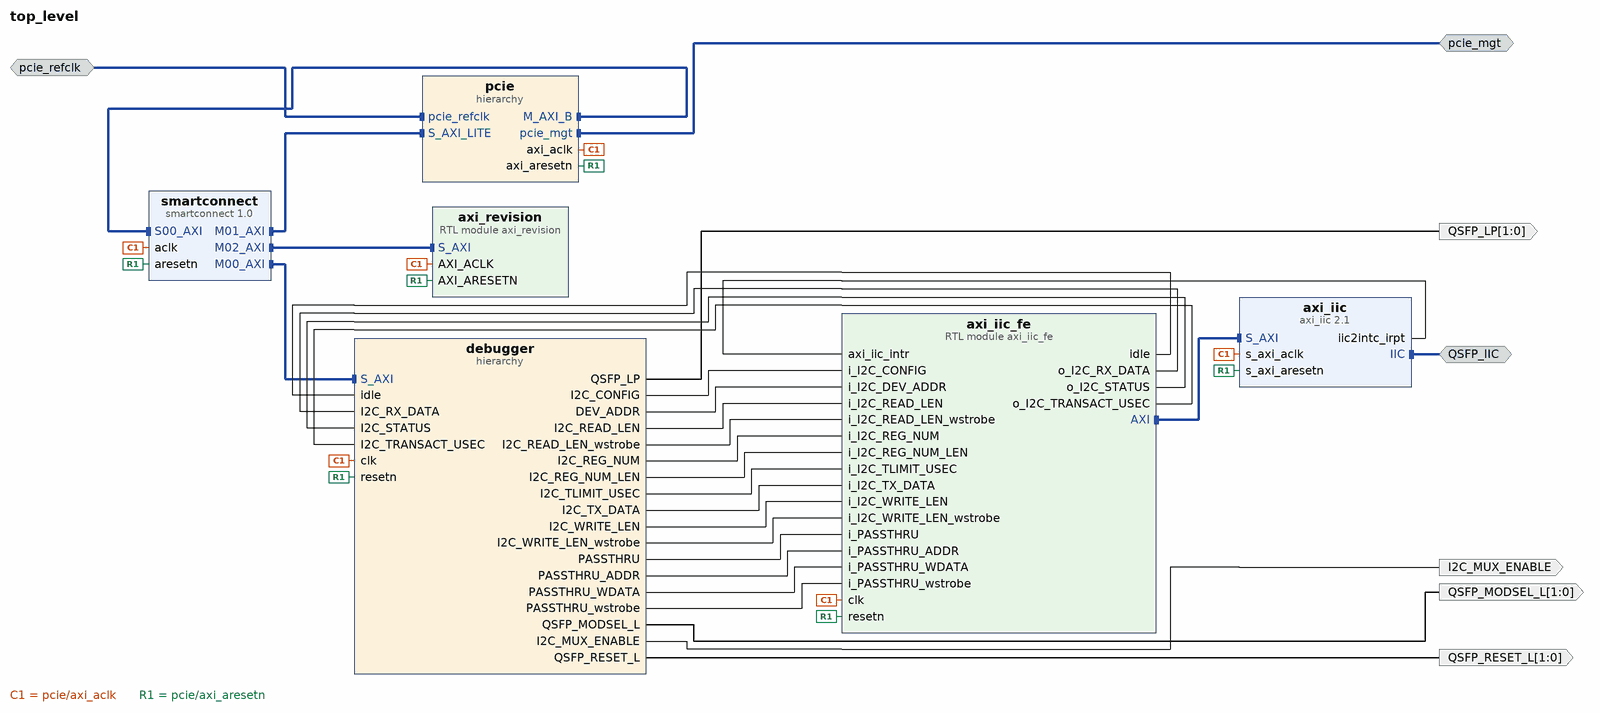
[diagram p0: block diagram of the top level]
# Vivado block design top_level, xcku15p-ffve1517-3-e, Vivado 2021.1
create_bd_design top_level

create_bd_intf_port -mode Slave -vlnv xilinx.com:interface:diff_clock_rtl:1.0 pcie_refclk
create_bd_intf_port -mode Master -vlnv xilinx.com:interface:pcie_7x_mgt_rtl:1.0 pcie_mgt
create_bd_intf_port -mode Master -vlnv xilinx.com:interface:iic_rtl:1.0 QSFP_IIC
create_bd_port -dir O -from 1 -to 0 QSFP_MODSEL_L
create_bd_port -dir O -from 1 -to 0 QSFP_RESET_L
create_bd_port -dir O -from 1 -to 0 QSFP_LP
create_bd_port -dir O I2C_MUX_ENABLE

create_bd_cell -type hier pcie
create_bd_cell -type ip -vlnv xilinx.com:ip:smartconnect:1.0 smartconnect
set_property -dict {CONFIG.NUM_CLKS 1 CONFIG.NUM_MI 3 CONFIG.NUM_SI 1} [get_bd_cells smartconnect]
create_bd_cell -type module -reference axi_revision axi_revision
create_bd_cell -type ip -vlnv xilinx.com:ip:axi_iic:2.1 axi_iic
create_bd_cell -type module -reference axi_iic_fe axi_iic_fe
set_property -dict {CONFIG.CLKS_PER_USEC 250} [get_bd_cells axi_iic_fe]
create_bd_cell -type hier debugger

# ---- hierarchy /pcie ----
current_bd_instance /pcie
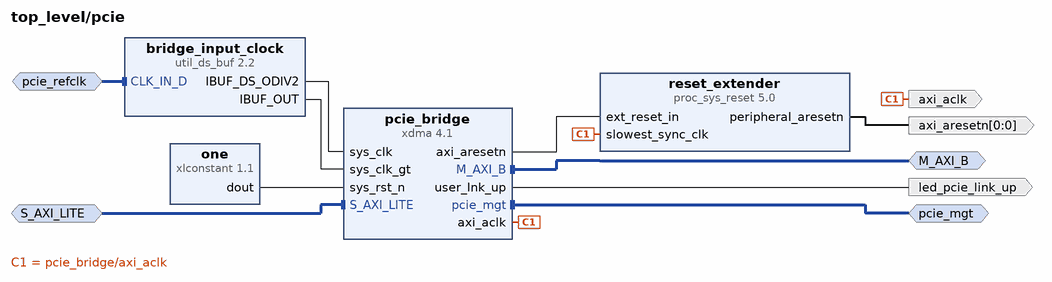
[diagram p1: block diagram inside /pcie]
create_bd_intf_pin -mode Master -vlnv xilinx.com:interface:aximm_rtl:1.0 M_AXI_B
create_bd_intf_pin -mode Slave -vlnv xilinx.com:interface:aximm_rtl:1.0 S_AXI_LITE
create_bd_intf_pin -mode Master -vlnv xilinx.com:interface:pcie_7x_mgt_rtl:1.0 pcie_mgt
create_bd_intf_pin -mode Slave -vlnv xilinx.com:interface:diff_clock_rtl:1.0 pcie_refclk
create_bd_pin -dir O led_pcie_link_up
create_bd_pin -dir O -type clk axi_aclk
create_bd_pin -dir O -from 0 -to 0 -type rst axi_aresetn

create_bd_cell -type ip -vlnv xilinx.com:ip:util_ds_buf:2.2 bridge_input_clock
set_property -dict {CONFIG.C_BUF_TYPE IBUFDSGTE} [get_bd_cells bridge_input_clock]
create_bd_cell -type ip -vlnv xilinx.com:ip:xdma:4.1 pcie_bridge
set_property -dict [list \
  CONFIG.PF0_DEVICE_ID_mqdma 903F \
  CONFIG.PF0_SRIOV_VF_DEVICE_ID A03F \
  CONFIG.PF2_DEVICE_ID_mqdma 923F \
  CONFIG.PF3_DEVICE_ID_mqdma 933F \
  CONFIG.axi_addr_width 64 \
  CONFIG.axi_data_width 512_bit \
  CONFIG.axisten_freq 250 \
  CONFIG.bridge_burst true \
  CONFIG.dma_reset_source_sel User_Reset \
  CONFIG.en_axi_slave_if false \
  CONFIG.enable_jtag_dbg false \
  CONFIG.functional_mode AXI_Bridge \
  CONFIG.mode_selection Advanced \
  CONFIG.pcie_blk_locn X0Y3 \
  CONFIG.pf0_bar0_scale Megabytes \
  CONFIG.pf0_bar0_size 1 \
  CONFIG.pf0_bar1_enabled true \
  CONFIG.pf0_bar1_scale Megabytes \
  CONFIG.pf0_bar1_size 1 \
  CONFIG.pf0_device_id 903F \
  CONFIG.pl_link_cap_max_link_speed 8.0_GT/s \
  CONFIG.pl_link_cap_max_link_width X16 \
  CONFIG.plltype QPLL1 \
] [get_bd_cells pcie_bridge]
create_bd_cell -type ip -vlnv xilinx.com:ip:xlconstant:1.1 one
create_bd_cell -type ip -vlnv xilinx.com:ip:proc_sys_reset:5.0 reset_extender

# ---- hierarchy /debugger ----
current_bd_instance /debugger
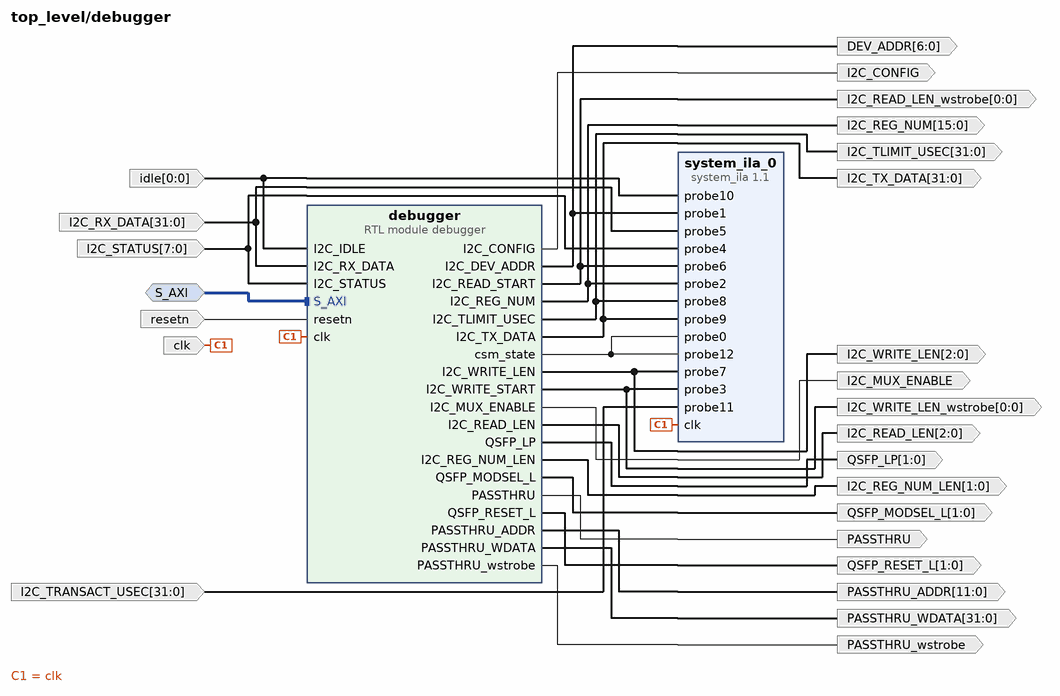
[diagram p2: block diagram inside /debugger]
create_bd_intf_pin -mode Slave -vlnv xilinx.com:interface:aximm_rtl:1.0 S_AXI
create_bd_pin -dir I -type clk clk
create_bd_pin -dir I -type rst resetn
create_bd_pin -dir O -from 1 -to 0 QSFP_MODSEL_L
create_bd_pin -dir O -from 1 -to 0 QSFP_RESET_L
create_bd_pin -dir O -from 1 -to 0 QSFP_LP
create_bd_pin -dir O I2C_MUX_ENABLE
create_bd_pin -dir O I2C_CONFIG
create_bd_pin -dir O -from 6 -to 0 DEV_ADDR
create_bd_pin -dir O -from 1 -to 0 I2C_REG_NUM_LEN
create_bd_pin -dir O -from 15 -to 0 I2C_REG_NUM
create_bd_pin -dir O -from 2 -to 0 I2C_READ_LEN
create_bd_pin -dir O -from 0 -to 0 I2C_READ_LEN_wstrobe
create_bd_pin -dir O -from 31 -to 0 I2C_TX_DATA
create_bd_pin -dir O -from 2 -to 0 I2C_WRITE_LEN
create_bd_pin -dir O -from 0 -to 0 I2C_WRITE_LEN_wstrobe
create_bd_pin -dir O -from 31 -to 0 I2C_TLIMIT_USEC
create_bd_pin -dir I -from 31 -to 0 I2C_RX_DATA
create_bd_pin -dir I -from 7 -to 0 I2C_STATUS
create_bd_pin -dir I -from 0 -to 0 idle
create_bd_pin -dir O PASSTHRU
create_bd_pin -dir O -from 31 -to 0 PASSTHRU_WDATA
create_bd_pin -dir O -from 11 -to 0 PASSTHRU_ADDR
create_bd_pin -dir O PASSTHRU_wstrobe
create_bd_pin -dir I -from 31 -to 0 I2C_TRANSACT_USEC

create_bd_cell -type ip -vlnv xilinx.com:ip:system_ila:1.1 system_ila_0
set_property -dict {CONFIG.C_MON_TYPE NATIVE CONFIG.C_NUM_OF_PROBES 15} [get_bd_cells system_ila_0]
create_bd_cell -type module -reference debugger debugger

# ---- connections ----

current_bd_instance /pcie
connect_bd_intf_net [get_bd_intf_pins pcie_refclk] [get_bd_intf_pins bridge_input_clock/CLK_IN_D]
connect_bd_intf_net -intf_net smartconnect_0_M01_AXI [get_bd_intf_pins S_AXI_LITE] [get_bd_intf_pins pcie_bridge/S_AXI_LITE]
connect_bd_intf_net -intf_net xdma_0_M_AXI_B [get_bd_intf_pins M_AXI_B] [get_bd_intf_pins pcie_bridge/M_AXI_B]
connect_bd_intf_net -intf_net xdma_0_pcie_mgt [get_bd_intf_pins pcie_mgt] [get_bd_intf_pins pcie_bridge/pcie_mgt]
connect_bd_net [get_bd_pins bridge_input_clock/IBUF_DS_ODIV2] [get_bd_pins pcie_bridge/sys_clk]
connect_bd_net [get_bd_pins bridge_input_clock/IBUF_OUT] [get_bd_pins pcie_bridge/sys_clk_gt]
connect_bd_net [get_bd_pins one/dout] [get_bd_pins pcie_bridge/sys_rst_n]
connect_bd_net [get_bd_pins pcie_bridge/axi_aresetn] [get_bd_pins reset_extender/ext_reset_in]
connect_bd_net -net proc_sys_reset_0_peripheral_aresetn [get_bd_pins reset_extender/peripheral_aresetn] [get_bd_pins axi_aresetn]
connect_bd_net -net xdma_0_axi_aclk [get_bd_pins pcie_bridge/axi_aclk] [get_bd_pins axi_aclk] [get_bd_pins reset_extender/slowest_sync_clk]
connect_bd_net -net xdma_0_user_lnk_up [get_bd_pins pcie_bridge/user_lnk_up] [get_bd_pins led_pcie_link_up]

current_bd_instance /debugger
connect_bd_intf_net -intf_net smartconnect_M00_AXI [get_bd_intf_pins S_AXI] [get_bd_intf_pins debugger/S_AXI]
connect_bd_net [get_bd_pins debugger/csm_state] [get_bd_pins system_ila_0/probe12] [get_bd_pins system_ila_0/probe0]
connect_bd_net -net axi_iic_fe_0_idle [get_bd_pins idle] [get_bd_pins system_ila_0/probe10] [get_bd_pins debugger/I2C_IDLE]
connect_bd_net -net axi_iic_fe_0_o_I2C_RX_DATA [get_bd_pins I2C_RX_DATA] [get_bd_pins system_ila_0/probe5] [get_bd_pins debugger/I2C_RX_DATA]
connect_bd_net -net axi_iic_fe_0_o_I2C_STATUS [get_bd_pins I2C_STATUS] [get_bd_pins system_ila_0/probe4] [get_bd_pins debugger/I2C_STATUS]
connect_bd_net -net axi_iic_fe_o_I2C_TRANSACT_USEC [get_bd_pins I2C_TRANSACT_USEC] [get_bd_pins system_ila_0/probe11]
connect_bd_net -net debugger_0_QSFP_LP [get_bd_pins debugger/QSFP_LP] [get_bd_pins QSFP_LP]
connect_bd_net -net debugger_0_QSFP_MODSEL_L [get_bd_pins debugger/QSFP_MODSEL_L] [get_bd_pins QSFP_MODSEL_L]
connect_bd_net -net debugger_0_QSFP_RESET_L [get_bd_pins debugger/QSFP_RESET_L] [get_bd_pins QSFP_RESET_L]
connect_bd_net [get_bd_pins debugger/I2C_CONFIG] [get_bd_pins I2C_CONFIG]
connect_bd_net [get_bd_pins debugger/I2C_DEV_ADDR] [get_bd_pins DEV_ADDR] [get_bd_pins system_ila_0/probe1]
connect_bd_net [get_bd_pins debugger/I2C_MUX_ENABLE] [get_bd_pins I2C_MUX_ENABLE]
connect_bd_net [get_bd_pins debugger/I2C_READ_LEN] [get_bd_pins I2C_READ_LEN]
connect_bd_net [get_bd_pins debugger/I2C_READ_START] [get_bd_pins I2C_READ_LEN_wstrobe] [get_bd_pins system_ila_0/probe6]
connect_bd_net [get_bd_pins debugger/I2C_REG_NUM] [get_bd_pins I2C_REG_NUM] [get_bd_pins system_ila_0/probe2]
connect_bd_net [get_bd_pins debugger/I2C_REG_NUM_LEN] [get_bd_pins I2C_REG_NUM_LEN]
connect_bd_net [get_bd_pins debugger/I2C_TLIMIT_USEC] [get_bd_pins I2C_TLIMIT_USEC] [get_bd_pins system_ila_0/probe8]
connect_bd_net [get_bd_pins debugger/I2C_TX_DATA] [get_bd_pins I2C_TX_DATA] [get_bd_pins system_ila_0/probe9]
connect_bd_net [get_bd_pins debugger/I2C_WRITE_LEN] [get_bd_pins I2C_WRITE_LEN] [get_bd_pins system_ila_0/probe7]
connect_bd_net [get_bd_pins debugger/I2C_WRITE_START] [get_bd_pins I2C_WRITE_LEN_wstrobe] [get_bd_pins system_ila_0/probe3]
connect_bd_net [get_bd_pins debugger/PASSTHRU] [get_bd_pins PASSTHRU]
connect_bd_net [get_bd_pins debugger/PASSTHRU_ADDR] [get_bd_pins PASSTHRU_ADDR]
connect_bd_net [get_bd_pins debugger/PASSTHRU_WDATA] [get_bd_pins PASSTHRU_WDATA]
connect_bd_net [get_bd_pins debugger/PASSTHRU_wstrobe] [get_bd_pins PASSTHRU_wstrobe]
connect_bd_net -net source_200Mhz_clk [get_bd_pins clk] [get_bd_pins system_ila_0/clk] [get_bd_pins debugger/clk]
connect_bd_net -net source_200Mhz_resetn [get_bd_pins resetn] [get_bd_pins debugger/resetn]

current_bd_instance /
connect_bd_intf_net -intf_net axi_iic_0_IIC [get_bd_intf_ports QSFP_IIC] [get_bd_intf_pins axi_iic/IIC]
connect_bd_intf_net -intf_net axi_iic_fe_0_AXI [get_bd_intf_pins axi_iic/S_AXI] [get_bd_intf_pins axi_iic_fe/AXI]
connect_bd_intf_net [get_bd_intf_ports pcie_refclk] [get_bd_intf_pins pcie/pcie_refclk]
connect_bd_intf_net -intf_net smartconnect_0_M01_AXI [get_bd_intf_pins pcie/S_AXI_LITE] [get_bd_intf_pins smartconnect/M01_AXI]
connect_bd_intf_net [get_bd_intf_pins debugger/S_AXI] [get_bd_intf_pins smartconnect/M00_AXI]
connect_bd_intf_net [get_bd_intf_pins smartconnect/M02_AXI] [get_bd_intf_pins axi_revision/S_AXI]
connect_bd_intf_net -intf_net xdma_0_M_AXI_B [get_bd_intf_pins pcie/M_AXI_B] [get_bd_intf_pins smartconnect/S00_AXI]
connect_bd_intf_net -intf_net xdma_0_pcie_mgt [get_bd_intf_ports pcie_mgt] [get_bd_intf_pins pcie/pcie_mgt]
connect_bd_net -net axi_iic_fe_0_idle [get_bd_pins axi_iic_fe/idle] [get_bd_pins debugger/idle]
connect_bd_net -net axi_iic_fe_0_o_I2C_RX_DATA [get_bd_pins axi_iic_fe/o_I2C_RX_DATA] [get_bd_pins debugger/I2C_RX_DATA]
connect_bd_net -net axi_iic_fe_0_o_I2C_STATUS [get_bd_pins axi_iic_fe/o_I2C_STATUS] [get_bd_pins debugger/I2C_STATUS]
connect_bd_net [get_bd_pins axi_iic_fe/o_I2C_TRANSACT_USEC] [get_bd_pins debugger/I2C_TRANSACT_USEC]
connect_bd_net [get_bd_pins axi_iic/iic2intc_irpt] [get_bd_pins axi_iic_fe/axi_iic_intr]
connect_bd_net -net debugger_0_QSFP_LP [get_bd_pins debugger/QSFP_LP] [get_bd_ports QSFP_LP]
connect_bd_net -net debugger_0_QSFP_MODSEL_L [get_bd_pins debugger/QSFP_MODSEL_L] [get_bd_ports QSFP_MODSEL_L]
connect_bd_net -net debugger_0_QSFP_RESET_L [get_bd_pins debugger/QSFP_RESET_L] [get_bd_ports QSFP_RESET_L]
connect_bd_net [get_bd_pins debugger/I2C_CONFIG] [get_bd_pins axi_iic_fe/i_I2C_CONFIG]
connect_bd_net -net debugger_I2C_DEV_ADDR [get_bd_pins debugger/DEV_ADDR] [get_bd_pins axi_iic_fe/i_I2C_DEV_ADDR]
connect_bd_net [get_bd_pins debugger/I2C_MUX_ENABLE] [get_bd_ports I2C_MUX_ENABLE]
connect_bd_net [get_bd_pins debugger/I2C_READ_LEN] [get_bd_pins axi_iic_fe/i_I2C_READ_LEN]
connect_bd_net -net debugger_I2C_READ_START [get_bd_pins debugger/I2C_READ_LEN_wstrobe] [get_bd_pins axi_iic_fe/i_I2C_READ_LEN_wstrobe]
connect_bd_net [get_bd_pins debugger/I2C_REG_NUM] [get_bd_pins axi_iic_fe/i_I2C_REG_NUM]
connect_bd_net [get_bd_pins debugger/I2C_REG_NUM_LEN] [get_bd_pins axi_iic_fe/i_I2C_REG_NUM_LEN]
connect_bd_net [get_bd_pins debugger/I2C_TLIMIT_USEC] [get_bd_pins axi_iic_fe/i_I2C_TLIMIT_USEC]
connect_bd_net [get_bd_pins debugger/I2C_TX_DATA] [get_bd_pins axi_iic_fe/i_I2C_TX_DATA]
connect_bd_net [get_bd_pins debugger/I2C_WRITE_LEN] [get_bd_pins axi_iic_fe/i_I2C_WRITE_LEN]
connect_bd_net -net debugger_I2C_WRITE_START [get_bd_pins debugger/I2C_WRITE_LEN_wstrobe] [get_bd_pins axi_iic_fe/i_I2C_WRITE_LEN_wstrobe]
connect_bd_net [get_bd_pins debugger/PASSTHRU] [get_bd_pins axi_iic_fe/i_PASSTHRU]
connect_bd_net [get_bd_pins debugger/PASSTHRU_ADDR] [get_bd_pins axi_iic_fe/i_PASSTHRU_ADDR]
connect_bd_net [get_bd_pins debugger/PASSTHRU_WDATA] [get_bd_pins axi_iic_fe/i_PASSTHRU_WDATA]
connect_bd_net [get_bd_pins debugger/PASSTHRU_wstrobe] [get_bd_pins axi_iic_fe/i_PASSTHRU_wstrobe]
connect_bd_net -net source_200Mhz_clk [get_bd_pins pcie/axi_aclk] \
  [get_bd_pins smartconnect/aclk] [get_bd_pins axi_revision/AXI_ACLK] [get_bd_pins axi_iic/s_axi_aclk] \
  [get_bd_pins axi_iic_fe/clk] [get_bd_pins debugger/clk]
connect_bd_net -net source_200Mhz_resetn [get_bd_pins pcie/axi_aresetn] \
  [get_bd_pins smartconnect/aresetn] [get_bd_pins axi_revision/AXI_ARESETN] [get_bd_pins axi_iic/s_axi_aresetn] \
  [get_bd_pins axi_iic_fe/resetn] [get_bd_pins debugger/resetn]

# ---- address map ----
assign_bd_address -offset 0x00000000 -range 64K -target_address_space [get_bd_addr_spaces axi_iic_fe/AXI] [get_bd_addr_segs axi_iic/S_AXI/Reg]
assign_bd_address -offset 0x0000000000000000 -range 128 -target_address_space [get_bd_addr_spaces pcie/pcie_bridge/M_AXI_B] [get_bd_addr_segs axi_revision/S_AXI/reg0]
assign_bd_address -offset 0x0000000000001000 -range 256 -target_address_space [get_bd_addr_spaces pcie/pcie_bridge/M_AXI_B] [get_bd_addr_segs debugger/debugger/S_AXI/reg0]
assign_bd_address -offset 0x0000000100000000 -range 256 -target_address_space [get_bd_addr_spaces pcie/pcie_bridge/M_AXI_B] [get_bd_addr_segs pcie/pcie_bridge/S_AXI_LITE/CTL0]

validate_bd_design
save_bd_design
